# EAGLE design monitor (EAGLE 9.3.2)
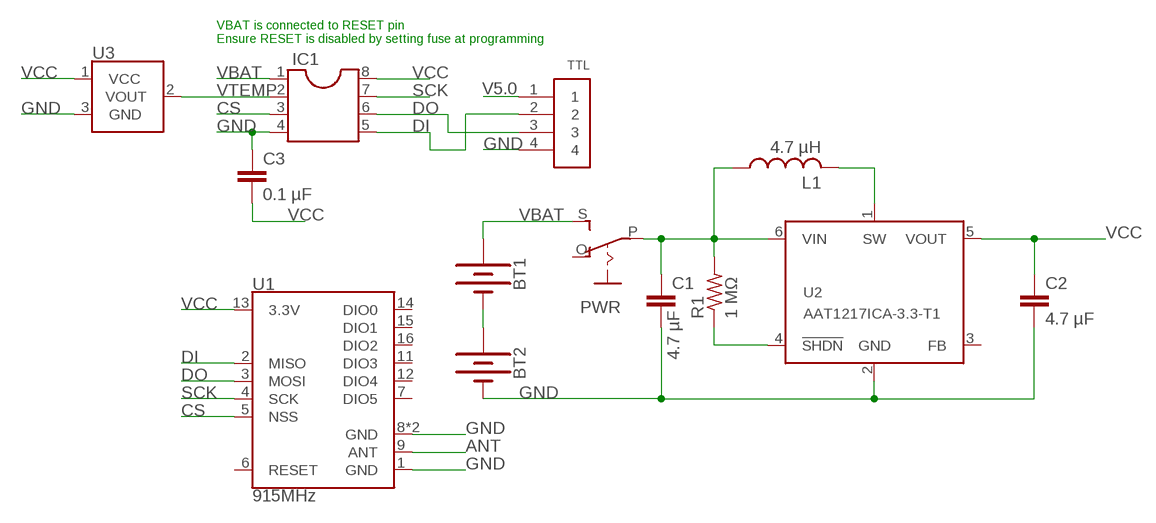
[diagram p0: schematic, sheet 1]

## Parts
BT1  BATTERY-AA  [BATTERY-AA]
BT2  BATTERY-AA  [BATTERY-AA]
C1  4.7 µF  C-EU025-025X050  [C025-025X050]
C2  4.7 µF  C-EU025-025X050  [C025-025X050]
C3  0.1 µF  C-EU025-025X050  [C025-025X050]
IC1  DIL8S  [SOCKET-08]
L1  4.7 µH  L-US0207/12  [0207/12]
PWR  EG1218S  [EG1218]
R1  1 MΩ  R-US_0204/5  [0204/5]
TTL  1X4-BIG  [1X04-BIG]
U1  915MHz  RFM69HCW-915  [RFM69HCW-XXXS2]
U2  AAT1217ICA-3.3-T1  [TSOT-23-6]
U3  TMP36GT9  [TO-92]

## Nets
ANT: U1.9(ANT)
CS: IC1.3 U1.5(NSS)
DI: IC1.5 TTL.2 U1.2(MISO)
DO: IC1.6 TTL.3 U1.3(MOSI)
GND: BT2.GND@1(-) C1.2 C2.2 C3.1 IC1.4 TTL.4 U1.1(GND) U1.8(GND) U1.10(GND) U2.2(GND) U3.3(GND)
N$2: BT1.GND@1(-) BT2.PWR@1(+)
N$3: BT1.PWR@1(+) PWR.S
SCK: IC1.7 U1.4(SCK)
SHDN: R1.1 U2.4(!SHDN)
SW: L1.2 U2.1(SW)
V5.0: TTL.1
VBAT: C1.1 IC1.1 L1.1 PWR.P R1.2 U2.6(VIN)
VCC: C2.1 C3.2 IC1.8 U1.13(3.3V) U2.5(VOUT) U3.1(VCC)
VTEMP: IC1.2 U3.2(VOUT)
Unconnected: PWR.O U1.6(RESET) U1.7(DIO5) U1.11(DIO3) U1.12(DIO4) U1.14(DIO0) U1.15(DIO1) U1.16(DIO2) U2.3(FB)

## Notes on the sheet
- VBAT is connected to RESET pin
  Ensure RESET is disabled by setting fuse at programming

## Library data of the parts
BT1 BT2 = SparkFun-Batteries:BATTERY: Battery - Single Cell A variety of battery chemistries, sizes, and footprints. Device List: 20MM_PTH - Coin Cell Battery Holder - 20mm (PTH) <https://www.sparkfun.com/products/783> 6.8MM_PTH - Coin Cell Battery Holder - 6.8MM(SMD) <https://www.digikey.com/product-detail/en/seiko-instruments/MS621FE-FL11E/728-1057-ND/1889208?WT.srch=1&gclid=CNOQ5a6LzdQCFZS2wAodXCkE0g> 12MM_SMD - Coin Cell Battery Holder - 12mm (SMD) <https://www.sparkfun.com/products/10592> 12MM_PTH - Coin Cell Battery Holder - 12mm (PTH) <https://www.sparkfun.com/products/7948> 20MM_SMD - 20mm Coin Cell Battery Holder (SMD) (2 legs) Used on the Big Time Watch Kit <https://www.sparkfun.com/products/11734> 20MM_SMD_4LEGS - Coin Cell Battery Holder - 20mm (SMD) <https://www.sparkfun.com/products/11892> 20MM_SMD_4LEGS_OVERPASTE - Coin Cell Battery Holder - 20mm (SMD) <https://www.sparkfun.com/products/11892> (Over-paste on the legs) 24.5MM_PTH - Coin Cell Battery Holder - 24.5mm (PTH) <https://www.sparkfun.com/products/8863> 9V - 9V Battery Holder - PC Mount Used on the SparkFun SparkPunk Sound Kit <https://www.sparkfun.com/products/11177> and SparkFun SparkPunk Sequencer Kit <https://www.sparkfun.com/products/12707> 18650 - Battery Holder - 18650 (PTH) <https://www.sparkfun.com/products/13113> AA - Battery Holder - 1xAA (PTH) <https://www.sparkfun.com/products/7949> AAA - Battery Holder - 1xAAA (PTH) <https://www.sparkfun.com/products/12718> AA_KIT - Battery Holder - 1xAA (PTH) <https://www.sparkfun.com/products/7949> Special kit package - pads only have exposed copper on one side of the board. AAA_KIT - Battery Holder - 1xAAA (PTH) <https://www.sparkfun.com/products/12718> Special kit package - pads only have exposed copper on one side of the board.; PROD_ID: BATT-08316; SF_SKU: PRT-07949
C1-C3 = rcl:C-EU: CAPACITOR, European symbol; SPICEPREFIX: C
IC1 = ic-package:DIL8: Dual In Line / Socket
L1 = rcl:L-US: INDUCTOR, American symbol; SPICEPREFIX: L
PWR = adafruit:EG1218: SLIDING SWITCH 0.1" spacing through hole, vertical SPDT slide switch http://www.ladyada.net/library/pcb/eaglelibrary.html
R1 = rcl:R-US_: RESISTOR, American symbol; SPICEPREFIX: R
TTL = adafruit:1X4: 4-pin connector
U1 = SparkFun-RF:RFM69H: Hope RF RFM69H ISM Transceiver Module The RFM69H is a transceiver module capable of operation over a wide frequency range, including the 315,433,868 and 915MHz license-free ISM (Industry Scientific and Medical) frequency bands. All major RF communication parameters are programmable and most of them can be dynamically set. The RFM69H offers the unique advantage of programmable narrow-band and wide- band communication modes. The RFM69H is optimized for low power consumption while offering high RF output power and channelized operation.Compliance ETSI and FCC regulations. Datasheet <http://www.hoperf.cn/upload/docs/RF/SX/RFM69H_DataSheet_v1.3.pdf> SparkFun Products RFM69HCW Wireless Transceiver - 915MHz <https://www.sparkfun.com/products/13909> (COM-13909) RFM69HCW Wireless Transceiver - 434MHz <https://www.sparkfun.com/products/13910> (COM-13910) SparkFun RFM69 Breakout (915MHz) <https://www.sparkfun.com/products/12775> (WRL-12775) SparkFun RFM69 Breakout (434MHz) <https://www.sparkfun.com/products/12823> (WRL-12823); PROD_ID: IC-11997
U2 = Skyworks:AAT1217
U3 = SparkFun-Sensors:TMP36: TMP36 Precision Analog °C Temperature Sensor The TMP36 is a low voltage, precision centigrade temperature sensor. It provides a voltage output that is linearly proportional to the Celsius temperature. It also doesn’t require any external calibration to provide typical accuracies of ±1°C at +25°C and ±2°C over the −40°C to +125°C temperature range. We like it because it’s so easy to use: Just give the device a ground and 2.7 to 5.5 VDC and read the voltage on the Vout pin. The output voltage can be converted to temperature easily using the scale factor of 10 mV/°C. Datasheet <http://cdn.sparkfun.com/datasheets/Sensors/Temp/TMP35_36_37.pdf> SparkFun Products Temperature Sensor - TMP36 <https://www.sparkfun.com/products/10988> (SEN-10988) SparkFun Danger Shield <https://www.sparkfun.com/products/11649> (DEV-11649); PROD_ID: IC-09880; SF_ID: SEN-10988

## Board
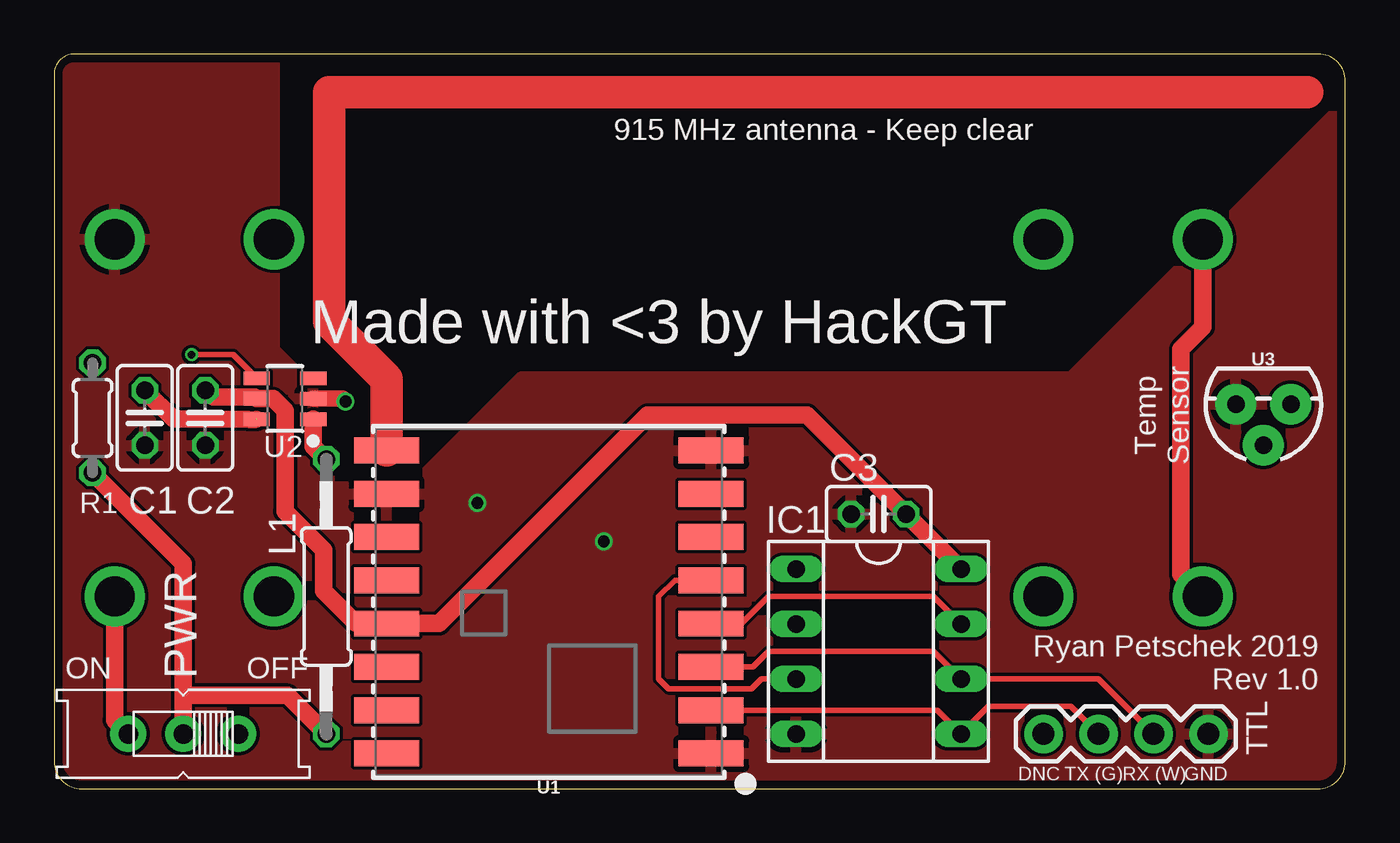
[diagram p1: board, top side]
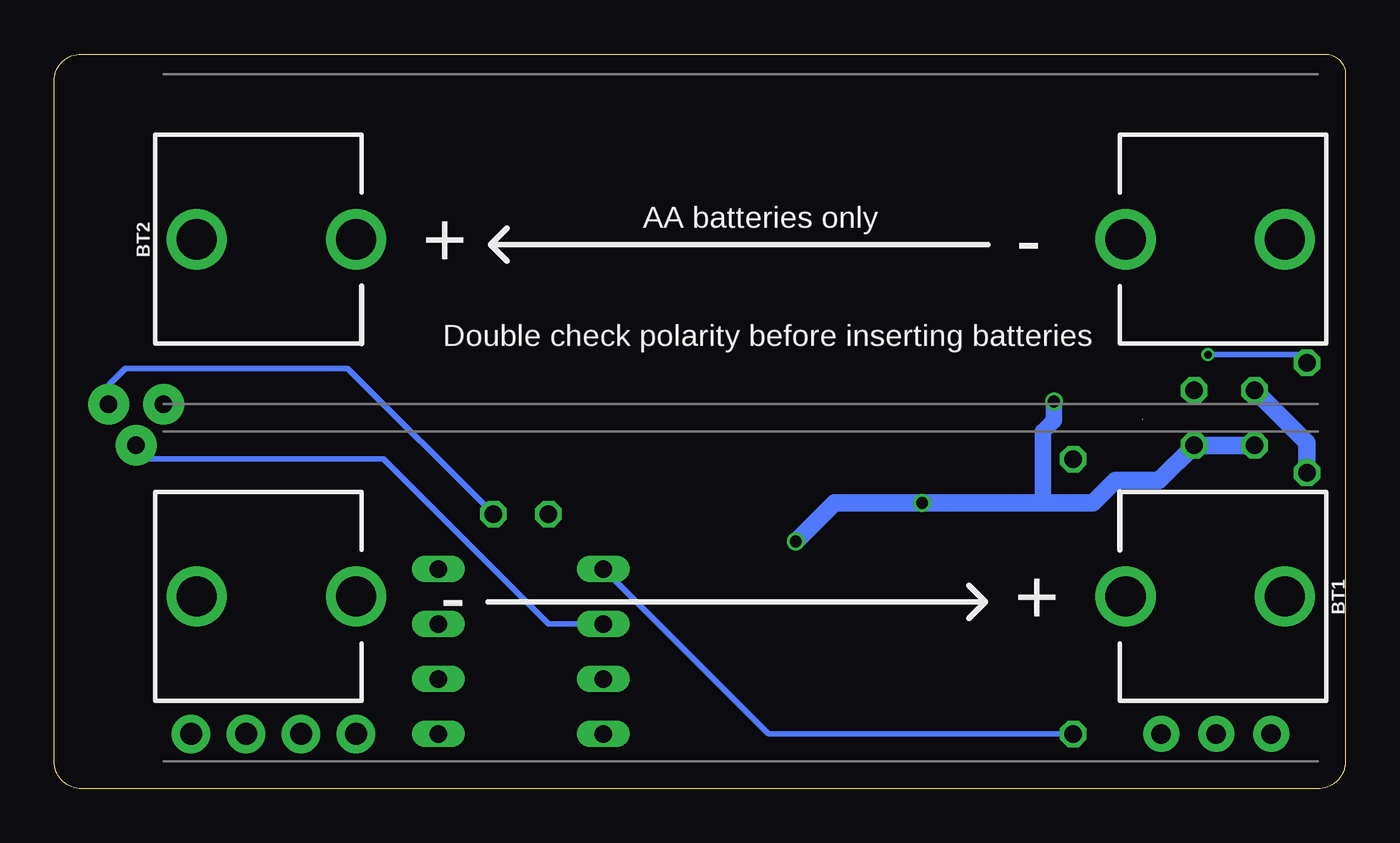
[diagram p2: board, bottom side, seen from below]

Size 59.67 x 33.96 mm. Coordinates in mm from the lower left corner, seen from the top.
Outline: 58.42,33.96 0.94,33.96 arc90 0,33.02 0,1.27 arc90 1.27,0 58.4,0 arc90 59.67,1.27 59.67,32.71 arc90 58.42,33.96
Copper layers (1*16): Top 0.035559375mm / dielectric 1.6mm / Bottom 0.035559375mm
Design rules "oshpark-2layer": minimum track width 6mil, minimum drill 10mil, track to track 6mil, track to pad 6mil, pad to pad 6mil, via to via 6mil, smd to smd 6mil, copper to edge 15mil, drill to drill 6mil, minimum pad ring 5mil, minimum via ring 5mil, stop-mask expansion 2.5mil, vias tented up to drill 0mil, thermal gap 10mil

### Footprints (pad centres in the part's own frame; a part is rotated, then mirrored left to right if it is on the bottom)
BATTERY-AA = drill 1.854: GND@1 25.146,0; GND@2 17.78,0; PWR@1 -25.146,0; PWR@2 -17.78,0
C025-025X050 = drill 0.813 octagon: 1 -1.27,0; 2 1.27,0
SOCKET-08 = drill 0.813 long: 1 -3.81,-3.81; 2 -1.27,-3.81; 3 1.27,-3.81; 4 3.81,-3.81; 5 3.81,3.81; 6 1.27,3.81; 7 -1.27,3.81; 8 -3.81,3.81
0207/12 = drill 0.813 octagon: 1 -6.35,0; 2 6.35,0
EG1218 = drill 0.9 pad 1.676: O -2.54,0; P 0,0; S 2.54,0
0204/5 = drill 0.813 octagon: 1 -2.54,0; 2 2.54,0
1X04-BIG = drill 1.016 pad 1.778: 1 0,0; 2 2.54,0; 3 5.08,0; 4 7.62,0
RFM69HCW-XXXS2 = smd 3 x 1.2: 1 -7.5,7; 2 -7.5,5; 3 -7.5,3; 4 -7.5,1; 5 -7.5,-1; 6 -7.5,-3; 7 -7.5,-5; 8 -7.5,-7; 9 7.5,-7; 10 7.5,-5; 11 7.5,-3; 12 7.5,-1; 13 7.5,1; 14 7.5,3; 15 7.5,5; 16 7.5,7
TSOT-23-6 = smd 1.22 x 0.62: 1 -1.31,0.95; 2 -1.31,0; 3 -1.31,-0.95; 4 1.31,-0.95; 5 1.31,0; 6 1.31,0.95
TO-92 = drill 0.813 pad 1.88: 1 -1.27,0; 2 0,1.905; 3 1.27,0

### Placement (x,y rotation side)
BT1  27.94,8.89 180 bottom
BT2  27.94,25.4 0 bottom
C1  4.19,17.14 270 top
C2  6.99,17.14 270 top
C3  38.1,12.7 0 top
IC1  38.1,6.35 270 top
L1  12.57,8.89 90 top
PWR  5.97,2.54 180 top
R1  1.78,17.14 270 top
TTL  45.72,2.54 0 top
U1  22.86,8.64 180 top
U2  10.67,18.03 180 top
U3  55.88,17.78 180 top

### Tracks (layer width: path | path; a pad name or v marks a point on that pad's centre or on a via)
ANT
  Top 1.499: U1.9 15.36,18.93 12.7,21.59 12.7,32.2 57.91,32.2
CS
  Top 0.254: U1.5 28.69,9.64 27.94,8.89 27.94,5.08 28.39,4.63 32.23,4.63 32.68,5.08 IC1.3
DI
  Top 0.254: U1.2 40.81,3.64 IC1.5 43.18,3.81 46.99,3.81 TTL.2
DO
  Top 0.254: U1.3 32.31,5.64 33.02,6.35 40.64,6.35 IC1.6 48.26,5.08 TTL.3
GND  (via drill 0.55)
  Top 0.762: U2.2 13.34,18.03 v13.46,17.91
  Bottom 0.762: v13.46,17.91 13.46,17.02 13.97,16.51 13.97,13.21
  Bottom 0.813: C1.2 C2.2 8.61,14.25 10.63,14.25 11.68,13.21 13.97,13.21 v19.56,13.21 23.62,13.21 v25.4,11.43
  pour Top: 60.96,0 0,0 0,34.29 10.16,34.29 10.16,20.32 12.7,17.78 12.7,13.97 16.51,13.97 21.59,19.05 46.99,19.05 60.96,33.02
N$2
  Top 0.813: BT2.PWR@1 53.09,21.34 52.07,20.32 52.07,9.91 BT1.GND@1
N$3
  Top 0.813: BT1.PWR@1 2.79,3.17 PWR.S
SCK
  Top 0.254: U1.4 31.77,7.64 33.02,8.89 40.64,8.89 IC1.7
SHDN  (via drill 0.35)
  Top 0.254: v6.35,20.07 8.28,20.07 U2.4
  Bottom 0.254: R1.1 2.16,20.07 v6.35,20.07
SW
  Top 0.813: U2.1 11.98,15.81 12.55,15.24 L1.2
VBAT  (1 unrouted)
  Top 0.787: 7.54,17.08 8.96,17.08 U2.6
  Top 0.813: PWR.P 5.97,4.32 | 5.97,4.32 5.97,10.41 R1.2 | L1.1 10.79,4.32 5.97,4.32 | C1.1 5.52,17.08 7.54,17.08
  Bottom 0.254: L1.1 26.67,2.54 IC1.1
  Bottom 0.813: R1.2 1.78,16 C1.1
VCC
  Top 0.813: IC1.8 C3.2 34.8,17.27 27.43,17.27 17.8,7.64 U1.13 13.95,7.64 12.45,9.14 12.45,11.05 10.67,12.83 10.67,17.48 10.12,18.03 U2.5 9.28,18.11 7.37,18.11 7.07,18.41 C2.1
  Bottom 0.254: C3.2 46.1,19.43 56.39,19.43 57.15,18.67 U3.1
VTEMP
  Bottom 0.254: IC1.2 36.83,7.62 44.45,15.24 55.24,15.24 U3.2

### Text on the board
tPlace: 915 MHz antenna - Keep clear | Made with <3 by HackGT | Ryan Petschek 2019 / Rev 1.0
bPlace: AA batteries only | Double check polarity before inserting batteries
tNames: Temp / Sensor | ON | OFF | DNC | TX (G) | RX (W) | GND